# Altium project Carrier_Board.PrjPcb (part 1 of 2)
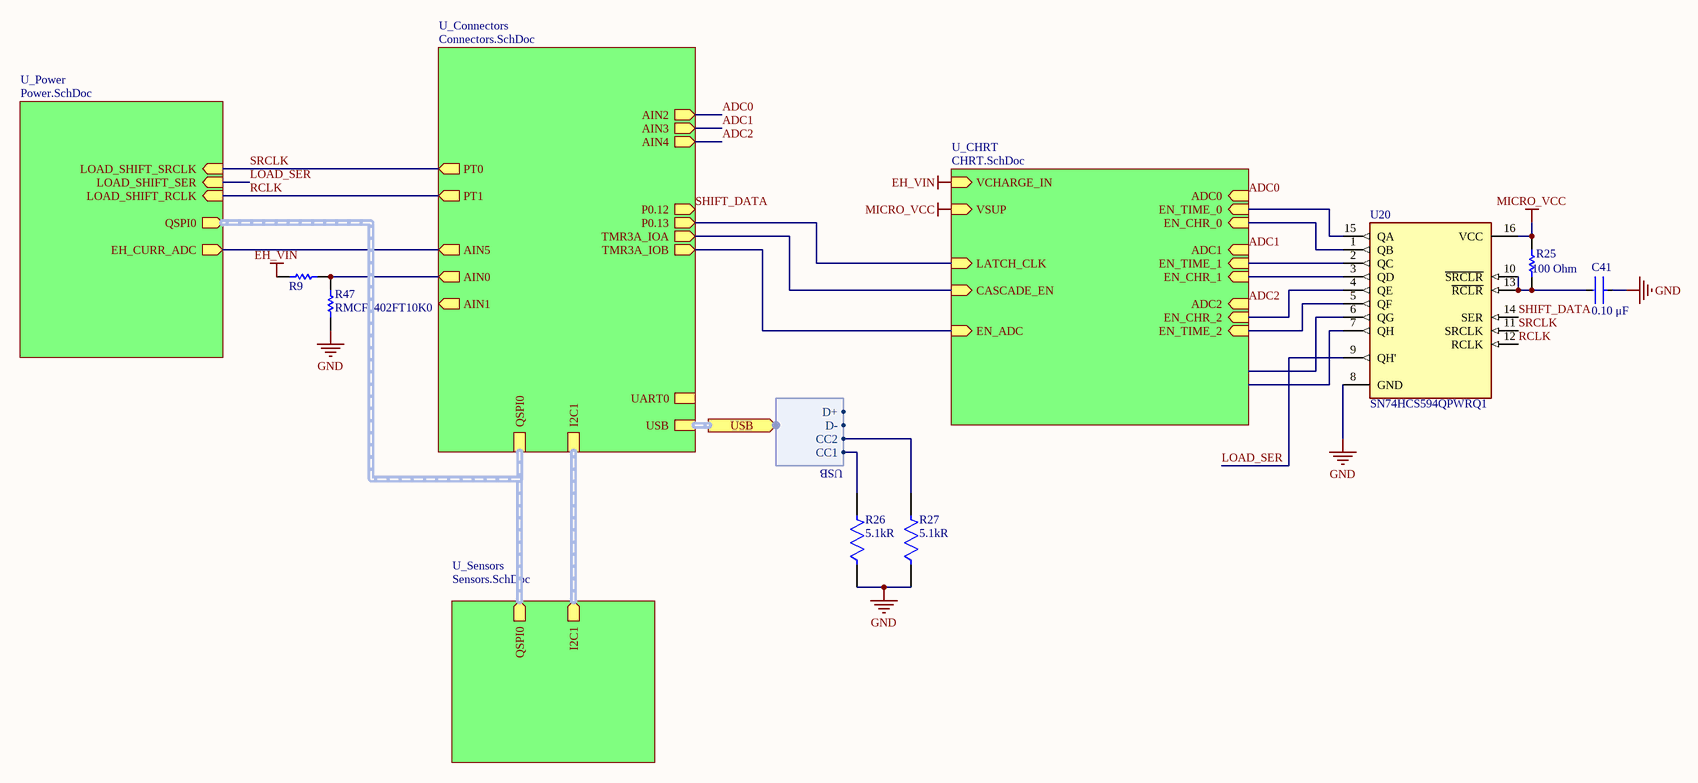
[diagram p0: TOP.SchDoc]
9 sheets, 204 parts. Net scope: hierarchical (ports join the sheet entries above them; power ports are global).
Board file: PCB2.PcbDoc
Sheets:
  TOP.SchDoc
    U_Sensors = Sensors.SchDoc
    U_Power = Power.SchDoc
      U_em_storage = em_storage.SchDoc
    U_Connectors = Connectors.SchDoc
    U_CHRT = CHRT.SchDoc
      HRT = HRT.SchDoc
      Cascade = Cascade.SchDoc
      U_HRT1 = HRT1.SchDoc

## Sheet TOP.SchDoc
size A3; SheetNumber: 1; SheetTotal: 9

### Parts
C41  Capacitance: 0.10 μF  [FP-C0402-BB-MFG]  (hidden comment: C0402C104K8PACTU)
R9  RC0402JR-075M6L  [RESC1005X40X25ML05T10]  (value not drawn)
R25  Resistance: 100 Ohm  [RESC1005X40X25LL05T05]  (hidden comment: ERJ-2RKF1000X)
R26  Resistance: 5.1kR  [FP-CRCW0402-e3-IPC_A]  (hidden comment: CRCW04025K10FKED)
R27  Resistance: 5.1kR  [FP-CRCW0402-e3-IPC_A]  (hidden comment: CRCW04025K10FKED)
R47  RMCF0402FT10K0  [RESC1005X40X25ML05T10]
U20  SN74HCS594QPWRQ1  [FP-PW0016A-IPC_A]

### Sub-sheets
U_CHRT = CHRT.SchDoc: VCHARGE_IN (in), VSUP (in), LATCH_CLK (in), CASCADE_EN (in), EN_ADC (in), ADC1 (in), EN_TIME_0 (in), ADC0 (in), EN_CHR_1 (in), EN_CHR_0 (in), EN_CHR_2 (in), EN_TIME_2 (in), EN_TIME_1 (in), ADC2 (in)
U_Connectors = Connectors.SchDoc: I2C1 (harness I2C1), QSPI0 (harness QSPI0), AIN2 (out), AIN3 (out), AIN4 (out), AIN5 (out), TMR3A_IOA (out), TMR3A_IOB (out), PT0 (out), PT1 (out), P0.12 (out), P0.13 (out), UART0 (harness *), USB (harness USB), AIN0 (out), AIN1 (out)
U_Power = Power.SchDoc: LOAD_SHIFT_SRCLK (in), LOAD_SHIFT_SER (in), LOAD_SHIFT_RCLK (in), QSPI0 (out, harness QSPI0), EH_CURR_ADC (out)
U_Sensors = Sensors.SchDoc: I2C1 (out, harness I2C1), QSPI0 (out, harness QSPI0)

### Ports
USB (out, harness USB)

### Harnesses
USB: CC1, CC2, D+, D-

### Nets
EH_VIN: R9.1 ; sheet U_CHRT/VCHARGE_IN
GND: C41.1 R26.1 R27.1 R47.1 U20.8(GND)
MICRO_VCC: R25.2 U20.16(VCC) ; sheet U_CHRT/VSUP
ADC0: sheet U_Connectors/AIN2, sheet U_CHRT/ADC0
ADC1: sheet U_Connectors/AIN3, sheet U_CHRT/ADC1
ADC2: sheet U_Connectors/AIN4, sheet U_CHRT/ADC2
AIN0: R9.2 R47.2 ; sheet U_Connectors/AIN0
AIN5: sheet U_Power/EH_CURR_ADC, sheet U_Connectors/AIN5
CASCADE_EN: sheet U_Connectors/TMR3A_IOA, sheet U_CHRT/CASCADE_EN
CC1: R26.2 ; port USB.CC1
CC2: R27.2 ; port USB.CC2
CLK: sheet U_Connectors/P0.13, sheet U_CHRT/LATCH_CLK
LOAD_SER: U20.9(QH') ; sheet U_Power/LOAD_SHIFT_SER
RCLK: U20.12(RCLK) ; sheet U_Power/LOAD_SHIFT_RCLK, sheet U_Connectors/PT1
SHIFT_DATA: U20.14(SER) ; sheet U_Connectors/P0.12
SRCLK: U20.11(SRCLK) ; sheet U_Power/LOAD_SHIFT_SRCLK, sheet U_Connectors/PT0
TMR3A_IOB: sheet U_Connectors/TMR3A_IOB, sheet U_CHRT/EN_ADC
NetC41_2: C41.2 R25.1 U20.10(~{SRCLR}) U20.13(~{RCLR})
NetR32_2: U20.3(QD) ; sheet U_CHRT/EN_CHR_1
NetR33_2: U20.1(QB) ; sheet U_CHRT/EN_CHR_0
NetR42_2: U20.4(QE) ; sheet U_CHRT/EN_CHR_2
NetU20_2: U20.2(QC) ; sheet U_CHRT/EN_TIME_1
NetU20_5: U20.5(QF) ; sheet U_CHRT/EN_TIME_2
NetU20_15: U20.15(QA) ; sheet U_CHRT/EN_TIME_0

Not connected (* = marked no-connect by the designer): U20 6(QG) 7(QH)

### Buses and harness runs
harness port USB = sheet U_Connectors/USB
harness sheet U_Connectors/I2C1 = sheet U_Sensors/I2C1
harness sheet U_Connectors/QSPI0 = sheet U_Power/QSPI0 = sheet U_Sensors/QSPI0

### Library data of the parts
C41 = CMP-2008-02046-2: CAP CER 0.1UF 10V X5R 0402; Manufacturer: Kemet; Material: Ceramic; Temperature Coefficient: 15%; Tolerance: 0.1; Value: 0.10 μF; Package: C0402-BB; Temperature: -55°C to +125°C; ComponentLink2Description: Datasheet; Temperature Characteristic: X5R; Device Class L1: Passive Components; Height: 0.55mm; Lead Free: Yes; ComponentLink2URL: https://content.kemet.com/datasheets/KEM_C1002_X7R_SMD.pdf; Device Class L2: Capacitors; Temperature Range Low: -55°C; Temperature Range High: +125°C; RoHS: TRUE; Octopart: https://octopart.com/c0402c104k8pactu-kemet-140039; Automotive: No; Mouser Description: Capacitor 100 nF 10 VDC 0402; Category: Cap; Voltage Rating: 10 V; Digikey Description: CAP CER 0.1UF 10V X5R 0402; Ipc Land Pattern Name: CAPC10050X50; Device Class L3: Ceramic Capacitors; Manufacturer Part Number: C0402C104K8PACTU
R9 = CMP-2002-07139-1: Manufacturer: Yageo / Phycomp; Part Number: RC0402JR-075M6L
R25 = CMP-2002-00605-3: Chip Resistor, 100 Ohm, +/- 1%, 100 mW, -55 to 155 degC, 0402 (1005 Metric), RoHS, Tape and Reel; Manufacturer: Basic Passives; Power Rating: 100 mW; Voltage Rating: 50 V; Case\/Package: 0402; Width: 0.5 mm; Pins: 2; ComponentLink2Description: Datasheet; PackageReference: 0402; Height: 0.35 mm; Tolerance: 1%; DatasheetVersion: 04/2015; Case Code (Imperial): 0402; Min Operating Temperature: -55 degC; Radiation Hardening: No; Length: 1 mm; Package Quantity: 10000; PackageDescription: 2-Pin Surface Mount Device, Body 1 x 0.5 mm; Mounting Technology: Surface Mount; Case Code (Metric): 1005; Packaging: Tape and Reel; ComponentLink1URL: http://www.panasonic.com/; RoHSCompliant: true; Max Operating Temperature: 155 degC; REACH SVHC: Yes; PartNumber: ERJ-2RKF1000X; ComponentLink1Description: Manufacturer URL; ComponentLink2URL: http://industrial.panasonic.com/cdbs/www-data/pdf/RDA0000/AOA0000C86.pdf; Mount: Surface Mount
R26 R27 = CMP-1011-00590-4: RES Thick Film, 5.1kΩ, 1%, 0.063W, 100ppm/°C, 0402; Voltage Rating: 50V; Max Power Dissipation: 63mW; Case/Package: 0402; Min Operating Temperature: -55°C; Height: 0.35mm; Contact Plating: Tin; Tolerance: 1%; Max Operating Temperature: 155°C; Lead Free: Lead Free; Number of Terminations: 2; Temperature Coefficient: 100ppm/°C; Weight: 2.3E-05oz; Termination: SMD/SMT; Radiation Hardening: No; Voltage Rating (DC): 50V; Length: 1mm; Features: Automotive AEC-Q200; Case Code (Metric): 1005; Width: 0.02inch; Package Quantity: 10; Military Standard: Not; Depth: 0.5mm; Packaging: Tape and Reel; Power Rating: 63mW; Case Code (Imperial): 0402; Composition: Thick Film
R47 = CMP-2002-07490-1: Manufacturer: Yageo / Phycomp; Part Number: RC0402FR-071ML
U20 = CMP-04904-000006-1: AUTOMOTIVE 8-BIT SHIFT REGISTERS

## Sheet Sensors.SchDoc
size A; SheetNumber: 2; SheetTotal: 9
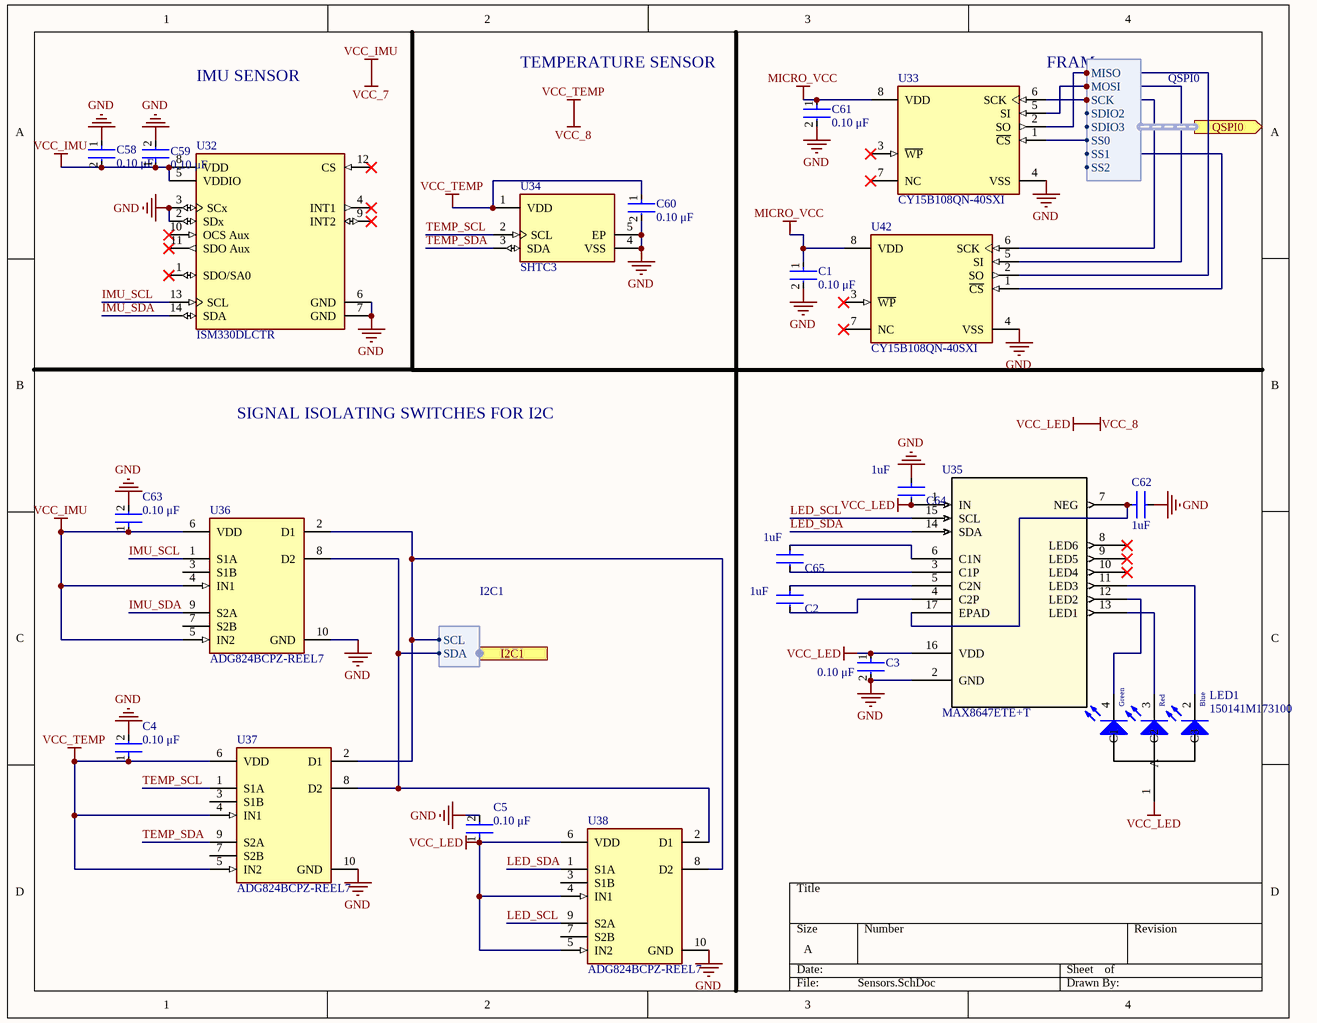
[diagram p1: Sensors.SchDoc]

### Parts
C1  Capacitance: 0.10 μF  [FP-C0402-BB-MFG]  (hidden comment: C0402C104K8PACTU)
C2  Capacitance: 1uF  [FP-GRM15-0_1-MFG]  (hidden comment: GRT155R61C105KE01J)
C3  Capacitance: 0.10 μF  [FP-C0402-BB-MFG]  (hidden comment: C0402C104K8PACTU)
C4  Capacitance: 0.10 μF  [FP-C0402-BB-MFG]  (hidden comment: C0402C104K8PACTU)
C5  Capacitance: 0.10 μF  [FP-C0402-BB-MFG]  (hidden comment: C0402C104K8PACTU)
C58  Capacitance: 0.10 μF  [FP-C0402-BB-MFG]  (hidden comment: C0402C104K8PACTU)
C59  Capacitance: 0.10 μF  [FP-C0402-BB-MFG]  (hidden comment: C0402C104K8PACTU)
C60  Capacitance: 0.10 μF  [FP-C0402-BB-MFG]  (hidden comment: C0402C104K8PACTU)
C61  Capacitance: 0.10 μF  [FP-C0402-BB-MFG]  (hidden comment: C0402C104K8PACTU)
C62  Capacitance: 1uF  [FP-GRM15-0_1-MFG]  (hidden comment: GRT155R61C105KE01J)
C63  Capacitance: 0.10 μF  [FP-C0402-BB-MFG]  (hidden comment: C0402C104K8PACTU)
C64  Capacitance: 1uF  [FP-GRM15-0_1-MFG]  (hidden comment: GRT155R61C105KE01J)
C65  Capacitance: 1uF  [FP-GRM15-0_1-MFG]  (hidden comment: GRT155R61C105KE01J)
LED1  150141M173100  [3528_A]
U32  ISM330DLCTR  [FP-LGA-14L-DM00249496-MFG]
U33  CY15B108QN-40SXI  [FP-001-85261-IPC_C]
U34  SHTC3  [FP-SHTC3-MFG]
U35  MAX8647ETE+T  [21-0136_T1633+5_MXM-L]
U36  ADG824BCPZ-REEL7  [FP-CP-10-10-MFG]
U37  ADG824BCPZ-REEL7  [FP-CP-10-10-MFG]
U38  ADG824BCPZ-REEL7  [FP-CP-10-10-MFG]
U42  CY15B108QN-40SXI  [FP-001-85261-IPC_C]

### Ports
I2C1 (out, harness I2C1), QSPI0 (out, harness QSPI0)

### Harnesses
I2C1: SCL, SDA
QSPI0: MISO, MOSI, SCK, SDIO2, SDIO3, SS0, SS1, SS2

### Nets
GND: C1.2 C3.2 C4.2 C5.2 C58.1 C59.2 C60.2 C61.2 C62.2 C63.2 C64.1 U32.2(SDx) U32.3(SCx) U32.6(GND) U32.7(GND) U33.4(VSS) U34.4(VSS) U34.5(EP) U35.2(GND) U36.10(GND) U37.10(GND) U38.10(GND) U42.4(VSS)
MICRO_VCC: C1.1 C61.1 U33.8(VDD) U42.8(VDD)
VCC_7: C58.2 C59.1 C63.1 U32.5(VDDIO) U32.8(VDD) U36.4(IN1) U36.5(IN2) U36.6(VDD)  [also labelled VCC_IMU]
VCC_8: C3.1 C4.1 C5.1 C60.1 C64.2 LED1.1(A) U34.1(VDD) U35.1(IN) U35.16(VDD) U37.4(IN1) U37.5(IN2) U37.6(VDD) U38.4(IN1) U38.5(IN2) U38.6(VDD)  [also labelled VCC_LED, VCC_TEMP]
I2C0_SCL: U42.1(~{CS}) ; port QSPI0.SS1
I2C1_SCL: U36.2(D1) U37.2(D1) U38.8(D2) ; port I2C1.SCL
I2C1_SDA: U36.8(D2) U37.8(D2) U38.2(D1) ; port I2C1.SDA
IMU_SCL: U32.13(SCL) U36.1(S1A)
IMU_SDA: U32.14(SDA) U36.9(S2A)
LED_SCL: U35.15(SCL) U38.9(S2A)
LED_SDA: U35.14(SDA) U38.1(S1A)
QSPI0_MISO: U33.2(SO) U42.2(SO) ; port QSPI0.MISO
QSPI0_MOSI: U33.5(SI) U42.5(SI) ; port QSPI0.MOSI
QSPI0_SCK: U33.6(SCK) U42.6(SCK) ; port QSPI0.SCK
QSPI0_SS0: U33.1(~{CS}) ; port QSPI0.SS0
TEMP_SCL: U34.2(SCL) U37.1(S1A)
TEMP_SDA: U34.3(SDA) U37.9(S2A)
NetC2_1: C2.1 U35.5(C2N)
NetC2_2: C2.2 U35.4(C2P)
NetC62_1: C62.1 U35.7(NEG) U35.17(EPAD)
NetC65_1: C65.1 U35.6(C1N)
NetC65_2: C65.2 U35.3(C1P)
NetLED1_2: LED1.2(C3) U35.11(LED3)
NetLED1_3: LED1.3(C2) U35.13(LED1)
NetLED1_4: LED1.4(C1) U35.12(LED2)

Not connected (* = marked no-connect by the designer): U32 1(SDO/SA0)* 4(INT1)* 9(INT2)* 10(OCS_Aux)* 11(SDO_Aux)* 12(CS)*; U33 3(~{WP})* 7(NC)*; U35 8(LED6)* 9(LED5)* 10(LED4)*; U36 3(S1B) 7(S2B); U37 3(S1B) 7(S2B); U38 3(S1B) 7(S2B); U42 3(~{WP})* 7(NC)*

### Notes on the sheet
- IMU SENSOR
- TEMPERATURE SENSOR
- (near U33) FRAM
- SIGNAL ISOLATING SWITCHES FOR I2C
- (in symbol CMP-1431-00001-1) Green; Red; Blue

### Library data of the parts
C1 C3-C5 C58-C61 C63 = CMP-2008-02046-2: as C41 on sheet TOP; Package: C0402-BB; Temperature: -55°C to +125°C; ComponentLink2Description: Datasheet; Temperature Characteristic: X5R; Device Class L1: Passive Components; Height: 0.55mm; Lead Free: Yes; ComponentLink2URL: https://content.kemet.com/datasheets/KEM_C1002_X7R_SMD.pdf; Device Class L2: Capacitors; Temperature Range Low: -55°C; Temperature Range High: +125°C; RoHS: TRUE; Octopart: https://octopart.com/c0402c104k8pactu-kemet-140039; Automotive: No; Mouser Description: Capacitor 100 nF 10 VDC 0402; Category: Cap; Voltage Rating: 10 V; Digikey Description: CAP CER 0.1UF 10V X5R 0402; Ipc Land Pattern Name: CAPC10050X50; Device Class L3: Ceramic Capacitors; Manufacturer Part Number: C0402C104K8PACTU
C2 C62 C64 C65 = CMP-2008-04556-2: CAP CER 1UF 10V X5R 0402; Manufacturer Part Number: GRM155R61A105KE15D; Manufacturer: Murata; Material: Ceramic; Tolerance: 10%; Temperature Coefficient: 15%; Octopart: https://octopart.com/grm155r61a105ke15d-murata-197442; Lead Free: Yes; ComponentLink2Description: Datasheet; Temperature: -55°C to +85°C; Temperature Range High: +85°C; Height: 0.55mm; Ipc Land Pattern Name: CAPC10050X50; ComponentLink2URL: https://search.murata.co.jp/Ceramy/image/img/A01X/G101/ENG/GRM155R61A105KE15-01A.pdf; Temperature Range Low: -55°C; Device Class L2: Capacitors; Voltage Rating: 10V; RoHS: TRUE; Device Class L1: Passive Components; Device Class L3: Ceramic Capacitors; Temperature Characteristic: X5R; Mouser Description: 0402 1 uF 10 V ±10% Tolerance X5R Surface Mount Multilayer Ceramic Capacitor; Automotive: No; Package: GRM15-0.1; Digikey Description: CAP CER 1UF 10V X5R 0402; Value: 1uF; Category: Cap
LED1 = CMP-1431-00001-1: SMD Full-Color Top LED, WL-SFTW, Red & Green & Blue; Manufacturer: Wuerth Elektronik; PackageReference: 3528_A; PartNumber: 150141M173100; ComponentLink2Description: Datasheet; ComponentLink1URL: http://www.we-online.com; Color: Red & Green & Blue; ComponentLink1Description: Manufacturer URL; ComponentLink2URL: http://katalog.we-online.com/led/datasheet/150141M173100.pdf
U32 = CMP-12177-000013-1: INEMO INERTIAL MODULE; Manufacturer: STMicroelectronics; Accel Range: 2/4/8/16g; Min Supply Voltage: 1.62V; Sensor Type: Temperature,Accelerometer,Gyroscope; Gyro Range: 125/250/500/1000/2000°/s; Sensor Output: I2C,SPI; Max Supply Voltage: 3.6V; Operating Supply Current: 0.35-0.75mA; Manufacturer Part Number: ISM330DLCTR; Category: IC; Height: 0.86mm; Octopart: https://octopart.com/ism330dlctr-stmicroelectronics-85149243; Device Class L2: Motion Sensors; Temperature Range Low: -40°C; Device Class L1: Sensors; Digikey Description: INEMO INERTIAL MODULE; Lead Free: Yes; Device Class L3: Inertial Measurement Units (IMUs); ComponentLink2URL: https://www.st.com/resource/en/datasheet/ism330dlc.pdf; Package: LGA-14L-DM00249496; RoHS: TRUE; Automotive: No; Footprint Url: https://www.st.com/content/ccc/resource/technical/document/technical_note/73/17/9c/16/dd/96/4a/01/CD00134799.pdf/files/CD00134799.pdf/jcr:content/translations/en.CD00134799.pdf; Temperature Range High: +85°C; Temperature: -40°C to +85°C; ComponentLink2Description: Datasheet
U33 U42 = CMP-12945-000022-1: IC FRAM 8MBIT 40MHZ 8EIAJ; RoHS Compliant: Yes
U34 = CMP-144040-000003-1: SENSOR HUMI/TEMP I2C 2% SMD; Manufacturer: Sensirion; Operating Supply Current: 0.3-900uA; Resolution: 16bits; Min Supply Voltage: 1.62V; Max Supply Voltage: 3.6V; Category: IC; Device Class L3: unset; ComponentLink2URL: https://www.sensirion.com/fileadmin/user_upload/customers/sensirion/Dokumente/0_Datasheets/Humidity/Sensirion_Humidity_Sensors_SHTC3_Datasheet.pdf; Ipc Land Pattern Name: DFN200X200X75-4; RoHS: TRUE; Height: 0.75mm; Interface: I2C; Temperature Range High: +125°C; Accuracy: 2%; Sensor Output: I2C; Automotive: No; Package: 0; Device Class L1: Sensors; Manufacturer Part Number: SHTC3; Digikey Description: SENSOR HUMI/TEMP I2C 2% SMD; Lead Free: Yes; Temperature: -40°C to +125°C; Device Class L2: Temperature and Humidity Sensors; ComponentLink2Description: Datasheet; Octopart: https://octopart.com/shtc3-sensirion-91912225; Mouser Description: SHTC3 Series 0 to 100% RH 3.6 V Humidity and Temperature Sensor IC - DFN-4; Temperature Range Low: -40°C
U35 = MAX8647ETE+T: No Description Available; SourceLibrary: Update_to_database_2021-01-29; Built_By: EMA_UL_Team; Vendor: Maxim Integrated Products; Revision: 4; Manufacturer_Part_Number: MAX8647ETE+T; Copyright: Copyright (C) 2021 Accelerated Designs. All rights reserved; RefDes: RefDes; Type: DEV
U36-U38 = CMP-09113-000012-1: IC SWITCH DUAL SPDT 10LFCSP; Manufacturer: Analog Devices; Nominal Supply Current: 0.003uA; Max Supply Voltage: 3.6V; Interface: LVCMOS; On State Resistance: 0.5Ω; -3Db Bandwith: 90MHz; Number Of Circuits: 2; Mux Demux Ratio: 1:2; Standoff Height: 0.02mm; Min Supply Voltage: 1.65V; Temperature: -40°C to +85°C; ComponentLink2URL: https://www.analog.com/media/en/technical-documentation/data-sheets/ADG824.pdf; Device Class L2: Interface ICs; Octopart: https://octopart.com/adg824bcpz-reel7-analog+devices-12410880; Temperature Range High: +85°C; Manufacturer Part Number: ADG824BCPZ-REEL7; Lead Free: Yes; Temperature Range Low: -40°C; ComponentLink2Description: Datasheet; Footprint Url: https://www.analog.com/media/en/symbols-footprints/symbols/ADG824BCPZ-REEL7.bxl; RoHS: TRUE; Device Class L3: Analog Switches; Device Class L1: Integrated Circuits (ICs); Automotive: No; Height: 0.6mm; Package: CP-10-10; Throw Configuration: SPDT; Category: IC; Digikey Description: IC SWITCH DUAL SPDT 10LFCSP

## Sheet Power.SchDoc
size A4; SheetNumber: 4; SheetTotal: 9
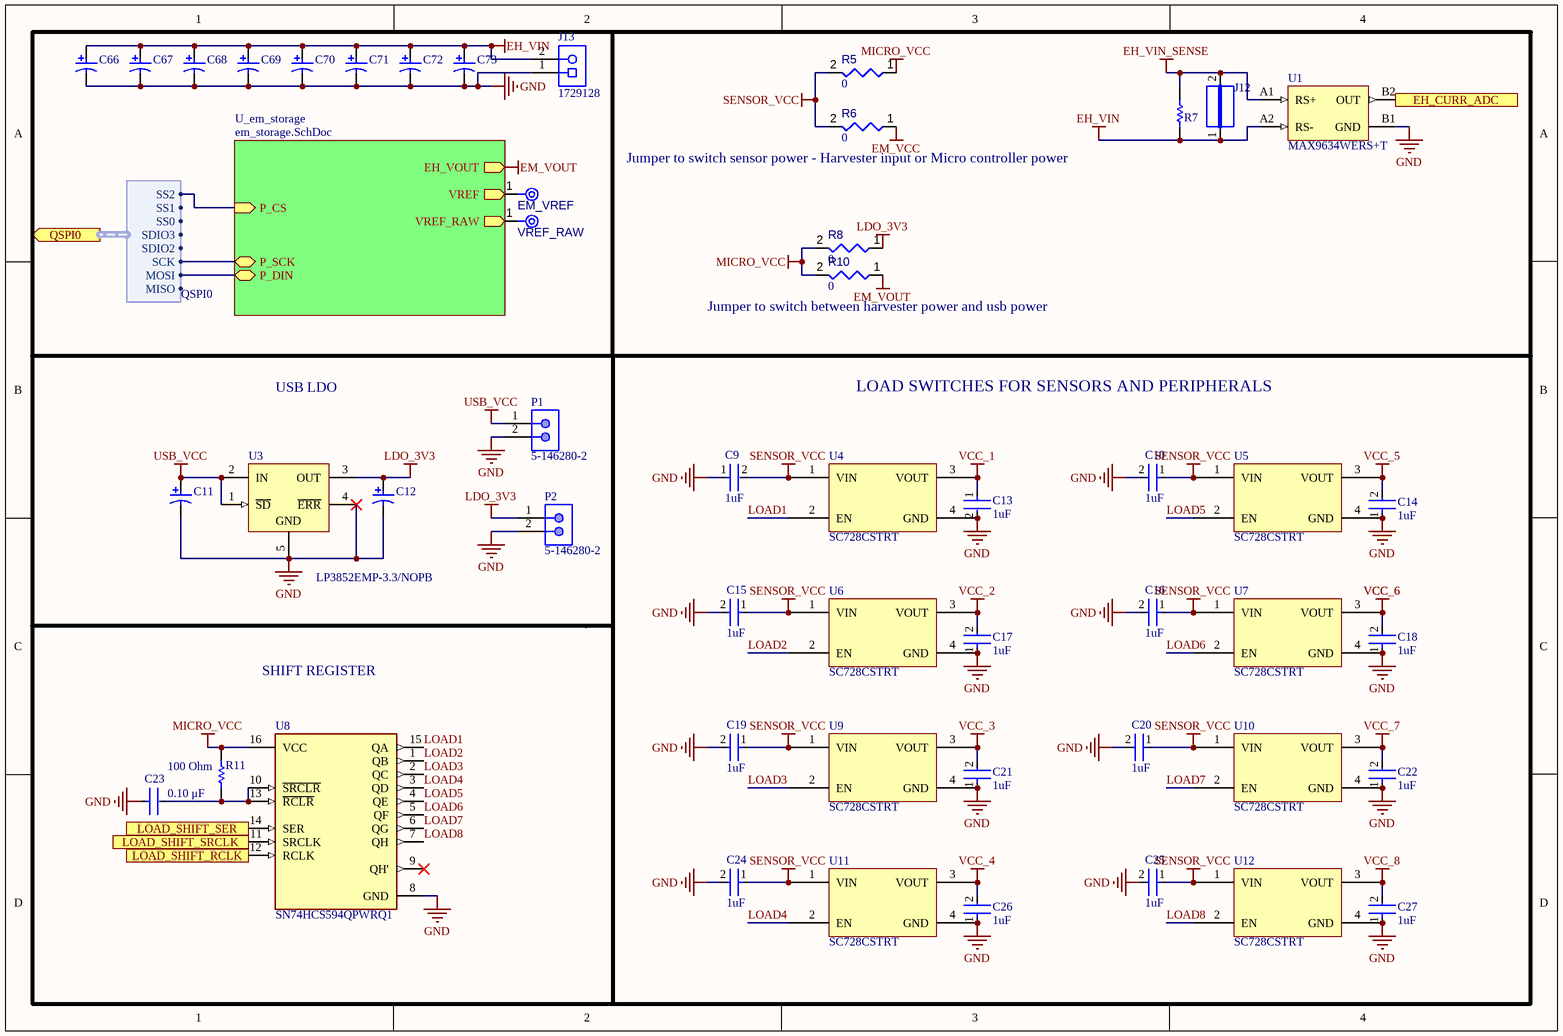
[diagram p2: Power.SchDoc]

### Parts
C9  Capacitance: 1uF  [FP-GRM15-0_1-MFG]  (hidden comment: GRT155R61C105KE01J)
C10  Capacitance: 1uF  [FP-GRM15-0_1-MFG]  (hidden comment: GRT155R61C105KE01J)
C11  T491D106K025AT  [KEMT-T491-D_L]  (value not drawn)
C12  T491D106K025AT  [KEMT-T491-D_L]  (value not drawn)
C13  Capacitance: 1uF  [FP-GRM15-0_1-MFG]  (hidden comment: GRT155R61C105KE01J)
C14  Capacitance: 1uF  [FP-GRM15-0_1-MFG]  (hidden comment: GRT155R61C105KE01J)
C15  Capacitance: 1uF  [FP-GRM15-0_1-MFG]  (hidden comment: GRT155R61C105KE01J)
C16  Capacitance: 1uF  [FP-GRM15-0_1-MFG]  (hidden comment: GRT155R61C105KE01J)
C17  Capacitance: 1uF  [FP-GRM15-0_1-MFG]  (hidden comment: GRT155R61C105KE01J)
C18  Capacitance: 1uF  [FP-GRM15-0_1-MFG]  (hidden comment: GRT155R61C105KE01J)
C19  Capacitance: 1uF  [FP-GRM15-0_1-MFG]  (hidden comment: GRT155R61C105KE01J)
C20  Capacitance: 1uF  [FP-GRM15-0_1-MFG]  (hidden comment: GRT155R61C105KE01J)
C21  Capacitance: 1uF  [FP-GRM15-0_1-MFG]  (hidden comment: GRT155R61C105KE01J)
C22  Capacitance: 1uF  [FP-GRM15-0_1-MFG]  (hidden comment: GRT155R61C105KE01J)
C23  Capacitance: 0.10 μF  [FP-C0402-BB-MFG]  (hidden comment: C0402C104K8PACTU)
C24  Capacitance: 1uF  [FP-GRM15-0_1-MFG]  (hidden comment: GRT155R61C105KE01J)
C25  Capacitance: 1uF  [FP-GRM15-0_1-MFG]  (hidden comment: GRT155R61C105KE01J)
C26  Capacitance: 1uF  [FP-GRM15-0_1-MFG]  (hidden comment: GRT155R61C105KE01J)
C27  Capacitance: 1uF  [FP-GRM15-0_1-MFG]  (hidden comment: GRT155R61C105KE01J)
C66  T491D106K025AT  [KEMT-T491-D_L]  (value not drawn)
C67  T491D106K025AT  [KEMT-T491-D_L]  (value not drawn)
C68  T491D106K025AT  [KEMT-T491-D_L]  (value not drawn)
C69  T491D106K025AT  [KEMT-T491-D_L]  (value not drawn)
C70  T491D106K025AT  [KEMT-T491-D_L]  (value not drawn)
C71  T491D106K025AT  [KEMT-T491-D_L]  (value not drawn)
C72  T491D106K025AT  [KEMT-T491-D_L]  (value not drawn)
C73  T491D106K025AT  [KEMT-T491-D_L]  (value not drawn)
EM_VREF  TPAD6R  [TP06R]  (value not drawn)  (no BOM)
J12  JUMPER  [JUMPER]  (value not drawn)
J13  1729128  [PHOE-1729128-2_V]
P1  5-146280-2  [TECO-5-146280-2_V]
P2  5-146280-2  [TECO-5-146280-2_V]
R5  value 0  [RESC0402(1005)_L]  (hidden comment: Jumper 0402)
R6  value 0  [RESC0402(1005)_L]  (hidden comment: Jumper 0402)
R7  WSL0603R0300FEA18  [RESC1508X46X38ML25T25]  (value not drawn)
R8  value 0  [RESC0402(1005)_L]  (hidden comment: Jumper 0402)
R10  value 0  [RESC0402(1005)_L]  (hidden comment: Jumper 0402)
R11  Resistance: 100 Ohm  [RESC1005X40X25LL05T05]  (hidden comment: ERJ-2RKF1000X)
U1  MAX9634WERS+T  [MAXM-R41A1+1]
U3  LP3852EMP-3.3/NOPB  [NDC0005A_L]
U4  SC728CSTRT  [CSp 4]
U5  SC728CSTRT  [CSp 4]
U6  SC728CSTRT  [CSp 4]
U7  SC728CSTRT  [CSp 4]
U8  SN74HCS594QPWRQ1  [FP-PW0016A-IPC_A]
U9  SC728CSTRT  [CSp 4]
U10  SC728CSTRT  [CSp 4]
U11  SC728CSTRT  [CSp 4]
U12  SC728CSTRT  [CSp 4]
VREF_RAW  TPAD6R  [TP06R]  (value not drawn)  (no BOM)

### Sub-sheets
U_em_storage = em_storage.SchDoc: P_SCK (bidir), P_DIN (bidir), P_CS (in), VREF_RAW (out), VREF (out), EH_VOUT (out)

### Ports
EH_CURR_ADC (out), LOAD_SHIFT_RCLK (in), LOAD_SHIFT_SER (in), LOAD_SHIFT_SRCLK (in), QSPI0 (out, harness QSPI0)

### Harnesses
QSPI0: MISO, MOSI, SCK, SDIO2, SDIO3, SS0, SS1, SS2

### Nets
EH_VIN: C66.1 C67.1 C68.1 C69.1 C70.1 C71.1 C72.1 C73.1 J12.1 J13.2 R7.1 U1.A2(RS-)
EH_VIN_SENSE: J12.2 R7.2 U1.A1(RS+)
EM_VCC: R6.1
EM_VOUT: R10.1 ; sheet U_em_storage/EH_VOUT
EM_VREF: EM_VREF.1(TP) ; sheet U_em_storage/VREF
GND: C9.1 C10.2 C11.2 C12.2 C13.2 C14.1 C15.2 C16.2 C17.1 C18.1 C19.2 C20.2 C21.1 C22.1 C23.1 C24.2 C25.2 C26.1 C27.1 C66.2 C67.2 C68.2 C69.2 C70.2 C71.2 C72.2 C73.2 J13.1 P1.2 P2.2 U1.B1(GND) U3.4(~{ERR}) U3.5(GND) U4.4(GND) U5.4(GND) U6.4(GND) U7.4(GND) U8.8(GND) U9.4(GND) U10.4(GND) U11.4(GND) U12.4(GND)
LDO_3V3: C12.1 P2.1 R8.1 U3.3(OUT)
MICRO_VCC: R5.1 R8.2 R10.2 R11.2 U8.16(VCC)
SENSOR_VCC: C9.2 C10.1 C15.1 C16.1 C19.1 C20.1 C24.1 C25.1 R5.2 R6.2 U4.1(VIN) U5.1(VIN) U6.1(VIN) U7.1(VIN) U9.1(VIN) U10.1(VIN) U11.1(VIN) U12.1(VIN)
USB_VCC: C11.1 P1.1 U3.1(~{SD}) U3.2(IN)
VCC_1: C13.1 U4.3(VOUT)
VCC_2: C17.2 U6.3(VOUT)
VCC_3: C21.2 U9.3(VOUT)
VCC_4: C26.2 U11.3(VOUT)
VCC_5: C14.2 U5.3(VOUT)
VCC_6: C18.2 U7.3(VOUT)
VCC_7: C22.2 U10.3(VOUT)
VCC_8: C27.2 U12.3(VOUT)
AIN5: U1.B2(OUT) ; port EH_CURR_ADC
I2C0_SDA: sheet U_em_storage/P_CS, port QSPI0.SS2
LOAD1: U4.2(EN) U8.15(QA)
LOAD2: U6.2(EN) U8.1(QB)
LOAD3: U8.2(QC) U9.2(EN)
LOAD4: U8.3(QD) U11.2(EN)
LOAD5: U5.2(EN) U8.4(QE)
LOAD6: U7.2(EN) U8.5(QF)
LOAD7: U8.6(QG) U10.2(EN)
LOAD8: U8.7(QH) U12.2(EN)
LOAD_SER: U8.14(SER) ; port LOAD_SHIFT_SER
QSPI0_MOSI: sheet U_em_storage/P_DIN, port QSPI0.MOSI
QSPI0_SCK: sheet U_em_storage/P_SCK, port QSPI0.SCK
RCLK: U8.12(RCLK) ; port LOAD_SHIFT_RCLK
SRCLK: U8.11(SRCLK) ; port LOAD_SHIFT_SRCLK
NetC23_2: C23.2 R11.1 U8.10(~{SRCLR}) U8.13(~{RCLR})
NetR16_2: VREF_RAW.1(TP) ; sheet U_em_storage/VREF_RAW

Not connected (* = marked no-connect by the designer): U8 9(QH')*

### Notes on the sheet
- Jumper to switch sensor power - Harvester input or Micro controller power
- (near R10) Jumper to switch between harvester power and usb power
- USB LDO
- LOAD SWITCHES FOR SENSORS AND PERIPHERALS
- SHIFT REGISTER

### Library data of the parts
C9 C10 C13-C22 C24-C27 = CMP-2008-04556-2: as C2 on sheet Sensors; Octopart: https://octopart.com/grm155r61a105ke15d-murata-197442; Lead Free: Yes; ComponentLink2Description: Datasheet; Temperature: -55°C to +85°C; Temperature Range High: +85°C; Height: 0.55mm; Ipc Land Pattern Name: CAPC10050X50; ComponentLink2URL: https://search.murata.co.jp/Ceramy/image/img/A01X/G101/ENG/GRM155R61A105KE15-01A.pdf; Temperature Range Low: -55°C; Device Class L2: Capacitors; Voltage Rating: 10V; RoHS: TRUE; Device Class L1: Passive Components; Device Class L3: Ceramic Capacitors; Temperature Characteristic: X5R; Mouser Description: 0402 1 uF 10 V ±10% Tolerance X5R Surface Mount Multilayer Ceramic Capacitor; Automotive: No; Package: GRM15-0.1; Digikey Description: CAP CER 1UF 10V X5R 0402; Value: 1uF; Category: Cap
C11 C12 C66-C73 = CMP-2000-07200-1: Tantalum Capacitor, 10 uF, +/- 10%, 25 V, -55 to 125 degC, 2-Pin SMD, RoHS, Tape and Reel; Manufacturer: Kemet; Insulation: NotRequired; Rad Hardened: No; Case Style: Molded; Polarity: Polar; Product Height (mm): 2.8mm; Capacitance: 10000000pF; Product Length (mm): 7.3mm; DF: 6%; ESR: 1ohm; Product Diameter (mm): NotRequiredmm; Voltage: 25VDC; Product Depth (mm): 4.3mm; DCL: 2.5uA; Mounting Style: SurfaceMount; Construction: SMTChip; Failure Rate: NotRequired; Operating Temp Range: -55Cto125C; Packaging: TapeandReel; Length W/Weld: NotRequiredmm; Package Reference: T491-D; Datasheet Version: 10/2016; Package / Case: 7343-31; Wire Form: NotRequired; Seated Plane Height: NotRequiredmm; Length W/Weld (max): NotRequiredmm; Package Description: 2-Pin Surface Mount Device, Body 7.3 x 4.3 mm; Tolerance (+ or -): 10%; Manufacturer URL: http://www.kemet.com/; Datasheet URL: http://capacitoredge.kemet.com/capedge2/DataSheet/Datasheet-T491D106K025AT.pdf?pn=T491D106K025AT; Case Code: D; Mounting Technology: SurfaceMount; Seal: NotRequired; Lead Spacing (nom): NotRequiredmm
C23 = CMP-2008-02046-2: as C41 on sheet TOP; Package: C0402-BB; Temperature: -55°C to +125°C; ComponentLink2Description: Datasheet; Temperature Characteristic: X5R; Device Class L1: Passive Components; Height: 0.55mm; Lead Free: Yes; ComponentLink2URL: https://content.kemet.com/datasheets/KEM_C1002_X7R_SMD.pdf; Device Class L2: Capacitors; Temperature Range Low: -55°C; Temperature Range High: +125°C; RoHS: TRUE; Octopart: https://octopart.com/c0402c104k8pactu-kemet-140039; Automotive: No; Mouser Description: Capacitor 100 nF 10 VDC 0402; Category: Cap; Voltage Rating: 10 V; Digikey Description: CAP CER 0.1UF 10V X5R 0402; Ipc Land Pattern Name: CAPC10050X50; Device Class L3: Ceramic Capacitors; Manufacturer Part Number: C0402C104K8PACTU
EM_VREF VREF_RAW = CMP-00028-00002-2: 0.6mm round; Pins: 1
J12 = CMP-009-00061-2: Pins: 2
J13 = CMP-2000-05815-1: PCB Terminal Block, 13.5 A, 400 V, 2-Pin THD, RoHS, Bulk; Manufacturer: Phoenix Contact; Package Version: 03/2015; No. of Rows: 1; Pitch: 5.08mm; No. of Positions: 2; Voltage Rating: 400V; Current Rating: 13500mA; Manufacturer URL: http://www.phoenixcontact.com/; Datasheet URL: https://datasheet.ciiva.com/16046/1729128-16046181.pdf; RoHS: TRUE; Package URL: https://www.phoenixcontact.com/online/portal/pi/pxc/product_detail_page/!ut/p/b1/3VdJjqNKFDxLH8AFycySyWY2ozFsEPOMMQaDOX1XedGL_1Vdm5YXJleknhSKeBkvI6EA8ncAo3AYoDhBQGco6KN7VURTdemj9us_IEKEZo_YHiPAEWEFmDGOHMORkqKYCORBZxgL7ZoaZYcbFFUZ3fqxSY6GOuxydWUuHqz1ynmMFygu583Bob0Ewr6Sd_l-5m-kAueHiB0jpRwZwe58wwtkpxtMYd_LmGcDRU02dRNEyWt6Y2ti5pSyJ_reIkzIulrqApdnbT11V5jnCKbYNCvhEM1MCpPByat_X379-iThf08CI5GfOPqfBeS3BRoBOdD55AKVv0iLwCMq-2BrzXWSGRH7pUGD9uwXQjiph3xL0DKQwdGa0JImiIOmBNOestqgwTHSSs2oOep-78apyXQBvNi8ZLaFjvjWvcaUEBu0MC6Wbe-d6mB0FAebo2lUWinqYaZs5DAYzV0RP9yitUjnGJ0iI9xhZkT42OCQNUJJhkgWINNQLP2JFP6OpMg3JCVg70jqHT0lvKOnhHf0lPuOnnLf0VPuWx6_dxwUIvwk5WMkT0kLL1mh61l2yZVSzG3pYV_bqo-mj6uMKwKwdnnW8Jh5RTOJzMOA5c-eJDaZQw4mTMPH02PvS_ZAqNVjVTo2WyYLkwH_KU1mmmG5kjRhDqPXLwwVHvVOjCM60-fpXvTDfMGW1PVFVS1r4e4yVDk4ZdNbkUHvqPqQSeian4UD39fNKmachqdJ1NJbyk8rXT9mXTvPk3oE5meulKGgiruPJek-4I9hTT6G8ZLOyRSm2RRVbThERQad5OS28hdt4YW4vG0stgYYzsWsK4_7y6DZMjJSCqri1kyiZR5vD7pwIrNR7QwPHTcLTI5qT7eRlpHrdGiupYlqQDJ7zy_CND8fWWBoLRXxk1RVcXiBQwbTD4Xi7KL-FuO94t9xaqweXzH; PartNumber: 1729128; Package Description: 2-Pin Through Hole Device, Body 8.1 x 10.16 mm, Pitch 5.08 mm; Datasheet Version: 12/2013; Mounting Technology: ThroughHole; Orientation: Horizontal; Package Reference: 1729128-2; Packing: Bulk
P1 P2 = CMP-2000-07492-1: Male Header, Pitch 2.54 mm, 1 x 2 Position, Height 8.21 mm, Tail Length 3.05 mm, -65 to 105 degC, RoHS, Bulk; Manufacturer: TE Connectivity; Mating Connector Lock: No(Without); Number of Positions: 2; Pitch: 2.54mm; PCB Mounting Orientation: Vertical; Keyed: No; Case\/Package: 100; Mating Post Length: 0.23inch; High Temperature Housing: Yes; Max Current Rating: 5A; PCB Thickness: 0.063inch; PCB Mount Retention: Without; Approvals: CSA; Current Rating: 3A; Radiation Hardening: No; Length: 4.67mm; Contact Mating Length: 0.23inch; Connector Type: Header; Number of Rows: 1; Termination Post Length: 0.12inch; Board Standoff: No(Without); Max Operating Temperature: 105degC; Contact Shape: Square; Selectively Loaded: No(Without); Gasket: No(Without); Number of Contacts: 2; Contact Gender: Male; Mating Alignment: No(Without); Manufacturer URL: http://www.te.com/; Datasheet URL: http://www.te.com/commerce/DocumentDelivery/DDEController?Action=showdoc&DocId=Customer+Drawing%7F146280%7FH1%7Fpdf%7FEnglish%7FENG_CD_146280_H1.pdf%7F5-146280-2; Mount: ThroughHole; Orientation: Straight; Packaging: Carton; Package Reference: 5-146280-2; Package Quantity: 500; Stabilizers: No(Without); Row Spacing: 2.54mm; Contact Material: CopperAlloy; Panel Mount Retention: No(Without); Datasheet Version: Rev. H1, 08/2016; Housing Colour: Black; Colour: Black; Package Description: Male Header, Pitch 2.54 mm, 1 x 2 Position, Height 8.21 mm, Tail Length 3.05 mm; Contact Plating: Matte; Housing Material: Polymer; Contact Protection: No(Without); Min Operating Temperature: -65degC; Mounting Technology: ThroughHole; Flammability Rating: UL94V-0; RoHSCompliant: true; Termination: ThroughHole; Depth: 2.34mm; High Speed Serial Data Connector: No
R5 R6 R8 R10 = CMP-009-00148-3: Pins: 2; Max Operating Temperature: 155°C; Min Operating Temperature: -55°C; Case/Package: 0402
R7 = CMP-2000-03807-1: Manufacturer: Vishay Dale; Part Number: WSL0603R0300FEA18
R11 = CMP-2002-00605-3: as R25 on sheet TOP; Width: 0.5 mm; Pins: 2; ComponentLink2Description: Datasheet; PackageReference: 0402; Height: 0.35 mm; Tolerance: 1%; DatasheetVersion: 04/2015; Case Code (Imperial): 0402; Min Operating Temperature: -55 degC; Radiation Hardening: No; Length: 1 mm; Package Quantity: 10000; PackageDescription: 2-Pin Surface Mount Device, Body 1 x 0.5 mm; Mounting Technology: Surface Mount; Case Code (Metric): 1005; Packaging: Tape and Reel; ComponentLink1URL: http://www.panasonic.com/; RoHSCompliant: true; Max Operating Temperature: 155 degC; REACH SVHC: Yes; PartNumber: ERJ-2RKF1000X; ComponentLink1Description: Manufacturer URL; ComponentLink2URL: http://industrial.panasonic.com/cdbs/www-data/pdf/RDA0000/AOA0000C86.pdf; Mount: Surface Mount
U1 = CMP-0252-00019-2: 1 uA, 4-Bump, Precision Current-Sense Amplifier, 200 V / V Gain, -40 to 85 degC, 4-Pin BGA (R41A1+1), Pb-Free, Tape and Reel; Gain: 25 V/V, 50 V/V ,100 V/V ,200 V/V; Bi-Dir. Curr. Sense: No; ComponentLink2Description: Datasheet; ComponentLink3URL: http://pdfserv.maximintegrated.com/package_dwgs/21-0242.PDF; Mounting Technology: Surface Mount; PackageVersion: Rev. A, 06/2008; ComponentLink2URL: http://datasheets.maximintegrated.com/en/ds/MAX9634.pdf; ComponentLink1URL: http://www.maximintegrated.com/; PartNumber: MAX9634WERS+T; PackageDescription: 4-Pin Ultra Chip-Scale Package, Body 1 x 1 mm, Pitch 0.5 mm; ComponentLink3Description: Package Specification; ComponentLink1Description: Manufacturer URL; PackageReference: R41A1+1; DatasheetVersion: Rev. 2
U3 = CMP-0062-01751-3: 1.5A Fast Ultra Low Dropout Linear Regulator, 5-pin SOT-223, Pb-Free; Manufacturer: Texas Instruments; PowerWise: N; PackageTopMarking: XYTT*LHVB; CompType: LDO IC; ComponentLink1Description: Datasheet URL; Code_JEDEC: TO-261-AB; PackageDescription: Moldec SOT-223, 6.50 x 3.56 x 1.6mm Body, 5 Lead, 1.5mm Pitch; PackageReference: NDC0005A; Code_IPC: SOT223-5; RoHS: Y; PinCount: 5; ComponentLink1URL: http://www.ti.com/general/docs/lit/getliterature.tsp?genericPartNumber=LP3852&fileType=pdf
U4-U7 U9-U12 = SC728CSTRT: pin to pad: 1>A1 2>A2 3>B1 4>B2
U8 = CMP-04904-000006-1: AUTOMOTIVE 8-BIT SHIFT REGISTERS

## Sheet em_storage.SchDoc
size A; SheetNumber: 5; SheetTotal: 9
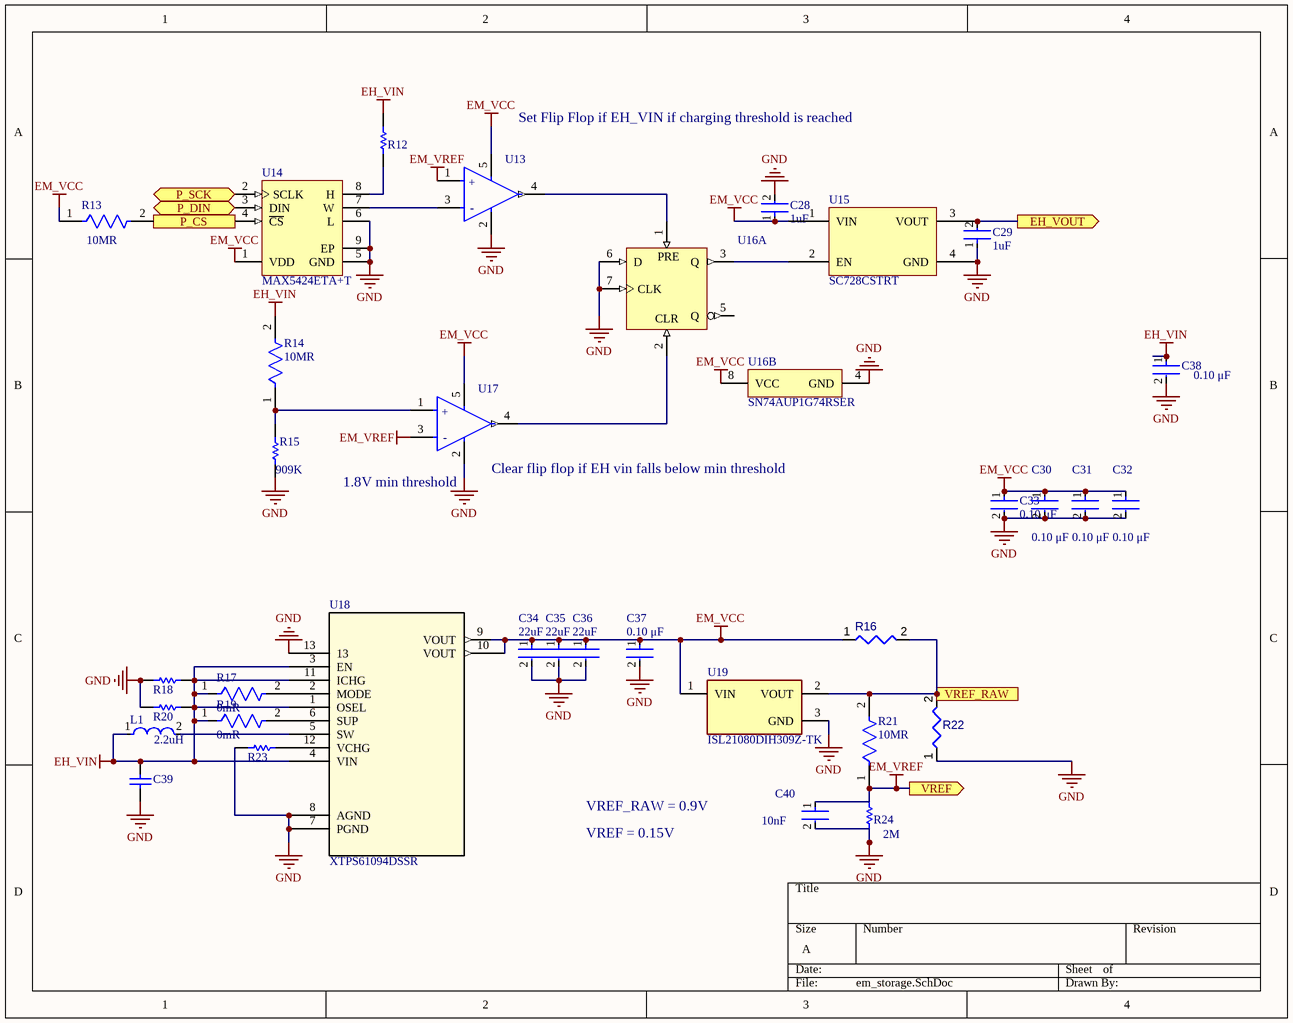
[diagram p3: em_storage.SchDoc]

### Parts
C28  Capacitance: 1uF  [FP-GRM15-0_1-MFG]  (hidden comment: GRT155R61C105KE01J)
C29  Capacitance: 1uF  [FP-GRM15-0_1-MFG]  (hidden comment: GRT155R61C105KE01J)
C30  Capacitance: 0.10 μF  [FP-C0402-BB-MFG]  (hidden comment: C0402C104K8PACTU)
C31  Capacitance: 0.10 μF  [FP-C0402-BB-MFG]  (hidden comment: C0402C104K8PACTU)
C32  Capacitance: 0.10 μF  [FP-C0402-BB-MFG]  (hidden comment: C0402C104K8PACTU)
C33  Capacitance: 0.10 μF  [FP-C0402-BB-MFG]  (hidden comment: C0402C104K8PACTU)
C34  Capacitance: 22uF  [FP-CL05A226MQ5N6J8-IPC_C]  (hidden comment: 04024D226MAT2A)
C35  Capacitance: 22uF  [FP-CL05A226MQ5N6J8-IPC_C]  (hidden comment: 04024D226MAT2A)
C36  Capacitance: 22uF  [FP-CL05A226MQ5N6J8-IPC_C]  (hidden comment: 04024D226MAT2A)
C37  Capacitance: 0.10 μF  [FP-C0402-BB-MFG]  (hidden comment: C0402C104K8PACTU)
C38  value 0.10 μF  [FP-C0402-BB-MFG]  (hidden comment: C0402C104K4RACTU)
C39  C0402C225M9PACTU  [CAPC1005X55X30NL05T10]  (value not drawn)
C40  Capacitance: 10nF  [FP-GRM155-0_05-IPC_C]  (hidden comment: GRM155R71H103KA88D)
L1  Inductance: 2.2uH  [FP-LQM21PH_G0-IPC_C]  (hidden comment: LQM21PN2R2NGCD)
R12  RMCF0402JT2M00  [RESC1005X40X25LL05T05]  (value not drawn)
R13  Resistance: 10MR  [FP-CRCW0402-e3-IPC_C]  (hidden comment: CRCW040210M0JNED)
R14  Resistance: 10MR  [FP-CRCW0402-e3-IPC_C]  (hidden comment: CRCW040210M0JNED)
R15  Resistance: 909K  [RESC1005X40X25NL05T05]  (hidden comment: ERJ-2RKF9093X)
R16  Jumper 0603  [RESC0603(1608)_L]  (value not drawn)
R17  Resistance: 0mR  [FP-CRCW0402-e3-IPC_C]  (hidden comment: CRCW04020000Z0ED)
R18  RC0402JR-070RL  [RESC1005X40X25NL05T10]  (value not drawn)
R19  Resistance: 0mR  [FP-CRCW0402-e3-IPC_C]  (hidden comment: CRCW04020000Z0ED)
R20  RC0402JR-070RL  [RESC1005X40X25NL05T10]  (value not drawn)
R21  Resistance: 10MR  [FP-CRCW0402-e3-IPC_C]  (hidden comment: CRCW040210M0JNED)
R22  Jumper 0603  [RESC0603(1608)_L]  (value not drawn)
R23  RC0402JR-070RL  [RESC1005X40X25NL05T10]  (value not drawn)
R24  Resistance: 2M  [RESC1005X40X25LL05T05]  (hidden comment: RMCF0402JT2M00)
U13  TLV3691IDCKR  [FP-DCK0005A-IPC_A]  (value not drawn)
U14  MAX5424ETA+T  [MAXM-T833+2_V]
U15  SC728CSTRT  [CSp 4]
U16  SN74AUP1G74RSER  [RSE0008A_V]  (value not drawn)  (parts A,B of 2)
U17  TLV3691IDCKR  [FP-DCK0005A-IPC_A]  (value not drawn)
U18  XTPS61094DSSR  [WSON_94DSSR_TEX-L]
U19  ISL21080DIH309Z-TK  [Intersil_ISL21080DIH309Z-TK_0]

### Ports
EH_VOUT (out), P_CS (in), P_DIN (bidir), P_SCK (bidir), VREF (out), VREF_RAW (out)

### Nets
EH_VIN: C38.1 C39.2 L1.1 R12.1 R14.2 R17.1 R18.2 R19.1 R20.2 U18.1(OSEL) U18.3(EN) U18.4(VIN) U18.11(ICHG)
EM_VCC: C28.1 C30.1 C31.1 C32.1 C33.1 C34.1 C35.1 C36.1 C37.1 R13.1 R16.1 U13.5(VCC) U14.1(VDD) U15.1(VIN) U16.8(VCC) U17.5(VCC) U18.9(VOUT) U18.10(VOUT) U19.1(VIN)
EM_VOUT: C29.2 U15.3(VOUT) ; port EH_VOUT
EM_VREF: C40.1 R21.1 R24.2 U13.1(IN+) U17.3(IN-) ; port VREF
GND: C28.2 C29.1 C30.2 C31.2 C32.2 C33.2 C34.2 C35.2 C36.2 C37.2 C38.2 C39.1 C40.2 R15.1 R18.1 R20.1 R22.1 R23.1 R24.1 U13.2(GND) U14.5(GND) U14.6(L) U14.9(EP) U15.4(GND) U16.4(GND) U16.6(D) U16.7(CLK) U17.2(GND) U18.7(PGND) U18.8(AGND) U18.13 U19.3(GND)
I2C0_SDA: R13.2 U14.4(~{CS}) ; port P_CS
QSPI0_MOSI: U14.3(DIN) ; port P_DIN
QSPI0_SCK: U14.2(SCLK) ; port P_SCK
NetL1_2: L1.2 U18.5(SW)
NetR12_2: R12.2 U14.8(H)
NetR14_1: R14.1 R15.2 U17.1(IN+)
NetR16_2: R16.2 R21.2 R22.2 U19.2(VOUT) ; port VREF_RAW
NetR17_2: R17.2 U18.2(MODE)
NetR19_2: R19.2 U18.6(SUP)
NetR23_2: R23.2 U18.12(VCHG)
NetU13_3: U13.3(IN-) U14.7(W)
NetU13_4: U13.4(OUT) U16.1(~{PRE})
NetU15_2: U15.2(EN) U16.3(Q)
NetU16_2: U16.2(~{CLR}) U17.4(OUT)

Not connected (* = marked no-connect by the designer): U16 5(Q)

### Notes on the sheet
- Set Flip Flop if EH_VIN if charging threshold is reached
- (near U17) 1.8V min threshold
- (near U17) Clear flip flop if EH vin falls below min threshold
- VREF_RAW = 0.9V
- VREF = 0.15V
- (in symbol CMP-0859-00978-3, part A) PRE; CLR
- (in symbol CMP-04896-000044-1) +; -

### Library data of the parts
C28 C29 = CMP-2008-04556-2: as C2 on sheet Sensors; Octopart: https://octopart.com/grm155r61a105ke15d-murata-197442; Lead Free: Yes; ComponentLink2Description: Datasheet; Temperature: -55°C to +85°C; Temperature Range High: +85°C; Height: 0.55mm; Ipc Land Pattern Name: CAPC10050X50; ComponentLink2URL: https://search.murata.co.jp/Ceramy/image/img/A01X/G101/ENG/GRM155R61A105KE15-01A.pdf; Temperature Range Low: -55°C; Device Class L2: Capacitors; Voltage Rating: 10V; RoHS: TRUE; Device Class L1: Passive Components; Device Class L3: Ceramic Capacitors; Temperature Characteristic: X5R; Mouser Description: 0402 1 uF 10 V ±10% Tolerance X5R Surface Mount Multilayer Ceramic Capacitor; Automotive: No; Package: GRM15-0.1; Digikey Description: CAP CER 1UF 10V X5R 0402; Value: 1uF; Category: Cap
C30-C33 C37 = CMP-2008-02046-2: as C41 on sheet TOP; Package: C0402-BB; Temperature: -55°C to +125°C; ComponentLink2Description: Datasheet; Temperature Characteristic: X5R; Device Class L1: Passive Components; Height: 0.55mm; Lead Free: Yes; ComponentLink2URL: https://content.kemet.com/datasheets/KEM_C1002_X7R_SMD.pdf; Device Class L2: Capacitors; Temperature Range Low: -55°C; Temperature Range High: +125°C; RoHS: TRUE; Octopart: https://octopart.com/c0402c104k8pactu-kemet-140039; Automotive: No; Mouser Description: Capacitor 100 nF 10 VDC 0402; Category: Cap; Voltage Rating: 10 V; Digikey Description: CAP CER 0.1UF 10V X5R 0402; Ipc Land Pattern Name: CAPC10050X50; Device Class L3: Ceramic Capacitors; Manufacturer Part Number: C0402C104K8PACTU
C34-C36 = CMP-13271-000001-1: CAP CER 22UF 6.3V X5R 0402; Manufacturer Part Number: CL05A226MQ5N6J8; Manufacturer: Samsung Electro-Mechanics; Material: Ceramic; Temperature Coefficient: 15%; Tolerance: 20%; Ipc Land Pattern Name: CAPC10050X50; Lead Free: Yes; Temperature Characteristic: X5R; Temperature: -55°C to +85°C; RoHS: TRUE; ComponentLink2Description: Datasheet; Device Class L3: Ceramic Capacitors; Device Class L1: Passive Components; Value: 22uF; Temperature Range High: +85°C; Automotive: No; Voltage Rating: 6.3V; Package: 0402; Category: Cap; Device Class L2: Capacitors; Height: 0.55mm; ComponentLink2URL: http://www.samsungsem.com/kr/support/library/product-catalog/__icsFiles/afieldfile/2018/11/28/MLCC.pdf; Temperature Range Low: -55°C; Octopart: https://octopart.com/cl05a226mq5n6j8-samsung-82337113; Digikey Description: CAP CER 22UF 6.3V X5R 0402
C38 = CMP-2008-02108-2: CAP CER 0.1UF 16V X7R 0402; Manufacturer: Kemet; Tolerance: 0.1; Material: Ceramic; Temperature Coefficient: 15%; Voltage Rating: 16 V; Package: C0402-BB; Automotive: No; Ipc Land Pattern Name: CAPC10050X50; Device Class L3: Ceramic Capacitors; Capacitance: 0.10 μF; Octopart: https://octopart.com/c0402c104k4ractu-kemet-94158; Temperature Characteristic: X7R; Mouser Description: Cap Ceramic 0.1uF 16V X7R 10% SMD 0402 125?C Paper T/R - Tape and Reel (Alt: C0402C104K4RAC TU); ComponentLink2Description: Datasheet; Temperature Range Low: -55°C; RoHS: TRUE; Device Class L1: Passive Components; Manufacturer Part Number: C0402C104K4RACTU; Temperature Range High: +125°C; Device Class L2: Capacitors; ComponentLink2URL: https://content.kemet.com/datasheets/KEM_C1002_X7R_SMD.pdf; Category: Cap; Height: 0.55mm; Temperature: -55°C to +125°C; Lead Free: Yes; Digikey Description: CAP CER 0.1UF 16V X7R 0402
C39 = CMP-2008-02064-2: Manufacturer: Kemet; Part Number: C0402C225M9PACTU
C40 = CMP-2008-04637-5: Chip Multilayer Ceramic Capacitors for General Purpose, 0402, 10000pF, X7R, 15%, 10%, 50V; Voltage: 25V; Tolerance: 10%; Mount: Surface Mount; Lead Free: Lead Free; Radiation Hardening: No; Case Code (Imperial): 0402; REACH SVHC: No SVHC; Case/Package: 0402; Dielectric: X7R; Voltage Rating (DC): 50V; Max Operating Temperature: 125°C; Termination: SMD/SMT; Material: Ceramic; Width: 0.02inch; Package Quantity: 1; Voltage Rating: 50V; Thickness: 0.022inch; Packaging: Tape and Reel; Height: 0.5mm; Number of Pins: 2; Case Code (Metric): 1005; Min Operating Temperature: -55°C; Length: 1mm; Depth: 0.5mm
L1 = CMP-06042-016317-1: Multilayer Type Inductor for Power Lines, 0805 (2012), 2.2μH, 30%, 0.288Ω, 0.8A; Test Frequency: 1MHz; Shielding: Shielded; Current Rating: 800mA; Self Resonant Frequency: 40MHz; Core Material: Ferrite; DC Resistance (DCR): 288mR; RoHS Compliant: Yes; REACH SVHC: No SVHC; Inductance Tolerance: 30%; Package Quantity: 4000; Military Standard: Not; Max Operating Temperature: 125°C; Radiation Hardening: No; Series: LQM; Height - Seated (Max): 0.039inch; Tolerance: 30%; Height: 0.9mm; Lead Free: Lead Free; Case Code (Metric): 2012; Packaging: Tape and Reel; Termination: SMD/SMT; Case Code (Imperial): 0805; Min Operating Temperature: -55°C; Depth: 1.4mm; Mount: Surface Mount; Length: 2mm; DC Current: 800mA; Case/Package: 0805; Max DC Current: 800mA; Width: 0.049inch
R12 = CMP-1011-00881-2: Manufacturer: Vishay Dale; Part Number: CRCW04022M00FKED; Resistance: 2M Ohm
R13 R14 R21 = CMP-1011-00170-3: RES Thick Film, 10MΩ, 5%, 0.063W, 200ppm/°C, 0402; Voltage Rating (DC): 50V; Max Power Dissipation: 63mW; Case Code (Metric): 1005; Tolerance: 5%; Lead Free: Lead Free; Length: 1mm; Packaging: Tape and Reel; Depth: 0.5mm; Composition: Thick Film; Temperature Coefficient: 200ppm/°C; Package Quantity: 1; Radiation Hardening: No; Weight: 2.3E-05oz; Width: 0.5mm; Military Standard: Not; Power Rating: 63mW; Case/Package: 0402; Termination: SMD/SMT; Height: 0.016inch; Voltage Rating: 50V; Contact Plating: Tin; Number of Terminations: 2; Features: Automotive AEC-Q200; Max Operating Temperature: 155°C; Case Code (Imperial): 0402; Min Operating Temperature: -55°C
R15 = CMP-2002-01101-1: Manufacturer: Panasonic; Part Number: ERJ-2RKF9093X
R16 R22 = CMP-009-00175-3: Value: 0; Pins: 2; Min Operating Temperature: -55°C; Max Operating Temperature: 155°C; Case/Package: 0603
R17 R19 = CMP-2002-08122-2: RES Thick Film, 0Ω, 0.063W, 0402; Tolerance: 5%; Max Power Dissipation: 63mW; Voltage Rating: 50V; Temperature Coefficient: 100ppm/°C; Contact Plating: Tin; Height: 0.35mm; Radiation Hardening: No; Features: Automotive AEC-Q200; Composition: Thick Film; Width: 0.5mm; Weight: 2.3E-05oz; Termination: SMD/SMT; Packaging: Tape and Reel; Mount: Surface Mount; Case Code (Metric): 1005; Military Standard: Not; Min Operating Temperature: -55°C; Number of Terminations: 2; Package Quantity: 1; Case Code (Imperial): 0402; Depth: 0.5mm; Max Operating Temperature: 155°C; Case/Package: 0402; Power Rating: 63mW; Lead Free: Lead Free; Voltage Rating (DC): 50V; Length: 1mm
R18 R20 R23 = CMP-1011-00001-2: Manufacturer: Yageo / Phycomp; Part Number: RC0402JR-070RL
R24 = CMP-1011-00881-2: Manufacturer: Vishay Dale; Part Number: CRCW04022M00FKED
U13 U17 = CMP-04896-000044-1: IC COMPARATOR NANO-POWER SC70-5; Max Supply Voltage: 6.5V; Propagation Delay: 35us; Quiescent Current: 150nA; Max Input Current: 100pA; Min Supply Voltage: 900mV; Number of Elements: 1; Min Dual Supply Voltage: 450mV; Max Dual Supply Voltage: 3.25V; Output Current: 42mA; Input Offset Voltage (Vos): 3mV; Response Time: 24us; Packaging: Tape and Reel; Type: General Purpose; RoHS Compliant: Yes; Number of Pins: 5; Max Operating Temperature: 125°C; Input Bias Current: 100pA; Mount: Surface Mount; Radiation Hardening: No; Contact Plating: Gold; Number of Channels: 1; Min Operating Temperature: -40°C; Package Quantity: 3000; Lead Free: Lead Free; Case/Package: SC
U14 = CMP-0023-00299-1: 200kOhm, Digital Potentiometer with 3-Wire Serial SPI Control Interface, Non-Volatile, Linear Taper, 256 Steps, -40 to 85 degC, 8-pin TDFN-EP (T833+2), Pb-Free, Tape and Reel; PartNumber: MAX5424ETA+T; ComponentLink3URL: http://pdfserv.maximintegrated.com/package_dwgs/21-0137.PDF; PackageDescription: 8-Pin Plastic Very Very Thin Dual Flatpack No Leads, Exposed Pad (T833+2); PackageVersion: Rev. J, 08/2009; ComponentLink2Description: Datasheet; ComponentLink1Description: Manufacturer URL; ComponentLink2URL: http://datasheets.maximintegrated.com/en/ds/MAX5422-MAX5424.pdf; Code_JEDEC: MO229; ComponentLink1URL: http://www.maximintegrated.com/; PackageReference: T833+2; Control Interface: 3-Wire Serial SPI; Features: EEPROM Wiper Memory; DatasheetVersion: Rev. 0; Mounting Technology: Surface Mount; ComponentLink3Description: Package Specification
U15 = SC728CSTRT: pin to pad: 1>A1 2>A2 3>B1 4>B2
U16 = CMP-0859-00978-3: Low-Power Single Positive-Edge-Triggered D-Type Flip-Flop, RSE0008A, LARGE T&R; Manufacturer: Texas Instruments; Bits(#): 1; VCC(Max)(V): 3.6; Voltage(Nom)(V): 0.8,1.2,1.5,1.8,2.5,3.3; Output Type: CMOS; Technology Family: AUP; VCC(Min)(V): 0.8; ICC @ Nom Voltage(Max)(mA): 0.0009; F @ Nom Voltage(Max)(Mhz): 100; Output Drive (IOL/IOH)(Max)(mA): 20/-20; Rating: Catalog; Schmitt Trigger: No; tpd @ Nom Voltage(Max)(ns): 38,26,17,13,9,7; Logic: True; Generic Part Number: SN74AUP1G74; Operating Temperature Range(C): -40 to 85; DatasheetVersion: SCES644C; Sub-Family: D-Type Flip-Flop; 3-State Output: No; PackageReference: RSE0008A; Input Type: CMOS
U18 = XTPS61094DSSR: No Description Available; SourceLibrary: Add_to_database_2021-03-17; Built_By: EMA_Matt; Vendor: Texas Instruments; Datasheet: https://www.ti.com/lit/ds/symlink/tps61094.pdf?ts=1615883226162; Manufacturer_Part_Number: XTPS61094DSSR; Copyright: Copyright (C) 2018 Accelerated Designs. All rights reserved; RefDes: RefDes; Type: DEV
U19 = IC_Intersil_ISL21080DIH309Z-TK_eec: IC VREF SERIES 0.9V SOT23-3; Part Number: ISL21080DIH309Z-TK; helpURL: https://upverter.com/upn/revision/cea4d3e56c7c7365/; ComponentLink2Description: Datasheet; Temperature: -40°C to +85°C; Package: SOT23-3; Supplier 2: Mouser; Price: 1.15623202851; Supplier 1: Digi-Key; ComponentLink1URL: https://upverter.com/upn/revision/cea4d3e56c7c7365/; Supplier Part Number 2: 968-ISL21080DIH309ZT; Supplier Part Number 1: ISL21080DIH309Z-TKCT-ND; Manufacturer: Intersil; ComponentLink1Description: Upverter; ComponentLink2URL: https://www.intersil.com/content/dam/Intersil/documents/isl2/isl21080.pdf; RoHS: TRUE; Mouser Part Number: 968-ISL21080DIH309ZT; Temperature Range High: +85°C; Digikey Description: IC VREF SERIES 0.9V SOT23-3; Digikey Part Number: ISL21080DIH309Z-TKCT-ND; Lead Free: yes; Temperature Range Low: -40°C